# EAGLE schematic MicroMod_MAX78000_V1.0 (EAGLE 9.6.2)
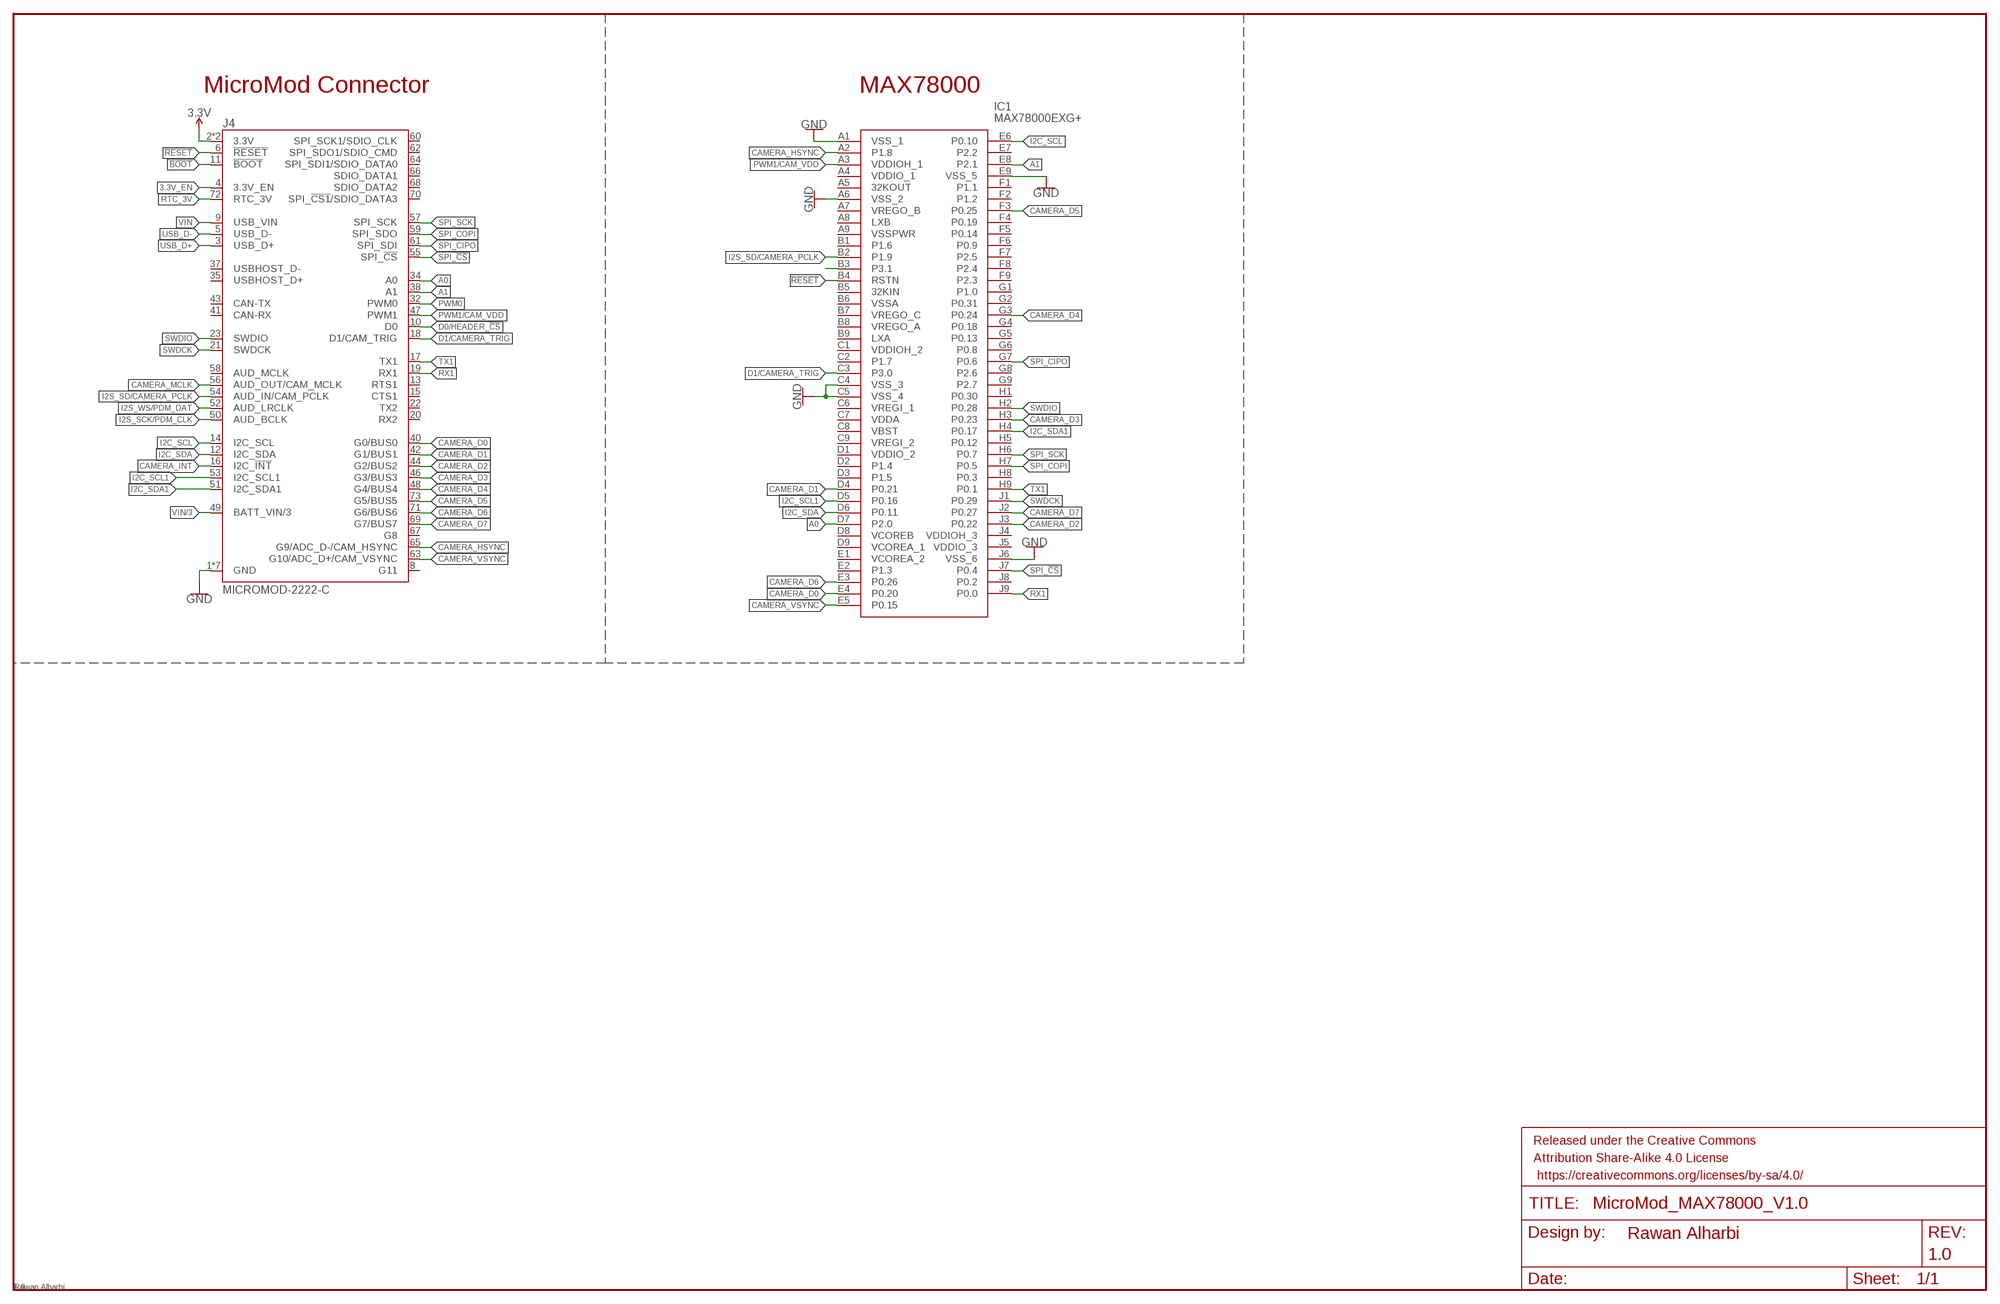
[diagram p0: schematic, sheet 1]

## Parts
FRAME1  FRAME-LEDGER  [CREATIVE_COMMONS]
IC1  MAX78000EXG+  [BGA81C80P9X9_800X800X130]
J4  MICROMOD-2222-C  [M.2-CONNECTOR-E]

## Nets
3.3V: J4.2(3.3V) J4.74(3.3V)
3.3V_EN: J4.4(3.3V_EN)
!BOOT!: J4.11(!BOOT!)
!RESET!: IC1.B4(RSTN) J4.6(!RESET!)
A0: IC1.D7(P2.0) J4.34(A0)
A1: IC1.E8(P2.1) J4.38(A1)
CAMERA_D0: IC1.E4(P0.20) J4.40(G0/BUS0)
CAMERA_D1: IC1.D4(P0.21) J4.42(G1/BUS1)
CAMERA_D2: IC1.J3(P0.22) J4.44(G2/BUS2)
CAMERA_D3: IC1.H3(P0.23) J4.46(G3/BUS3)
CAMERA_D4: IC1.G3(P0.24) J4.48(G4/BUS4)
CAMERA_D5: IC1.F3(P0.25) J4.73(G5/BUS5)
CAMERA_D6: IC1.E3(P0.26) J4.71(G6/BUS6)
CAMERA_D7: IC1.J2(P0.27) J4.69(G7/BUS7)
CAMERA_HSYNC: IC1.A2(P1.8) J4.65(G9/ADC_D-/CAM_HSYNC)
CAMERA_INT: J4.16(I2C_!INT!)
CAMERA_MCLK: J4.56(AUD_OUT/CAM_MCLK)
CAMERA_VSYNC: IC1.E5(P0.15) J4.63(G10/ADC_D+/CAM_VSYNC)
D0/HEADER_!CS!: J4.10(D0)
D1/CAMERA_TRIG: IC1.C3(P3.0) J4.18(D1/CAM_TRIG)
GND: IC1.A1(VSS_1) IC1.A6(VSS_2) IC1.C4(VSS_3) IC1.C5(VSS_4) IC1.E9(VSS_5) IC1.J6(VSS_6) J4.1(GND) J4.7(GND) J4.33(GND) J4.36(GND) J4.39(GND) J4.45(GND) J4.75(GND)
I2C_SCL: IC1.E6(P0.10) J4.14(I2C_SCL)
I2C_SCL1: IC1.D5(P0.16) J4.53(I2C_SCL1)
I2C_SDA: IC1.D6(P0.11) J4.12(I2C_SDA)
I2C_SDA1: IC1.H4(P0.17) J4.51(I2C_SDA1)
I2S_SCK/PDM_CLK: J4.50(AUD_BCLK)
I2S_SD/CAMERA_PCLK: IC1.B2(P1.9) J4.54(AUD_IN/CAM_PCLK)
I2S_WS/PDM_DAT: J4.52(AUD_LRCLK)
N$1: IC1.B3(P3.1)
PWM0: J4.32(PWM0)
PWM1/CAM_VDD: IC1.A3(VDDIOH_1) J4.47(PWM1)
RTC_3V: J4.72(RTC_3V)
RX1: IC1.J9(P0.0) J4.19(RX1)
SPI_!CS!: IC1.J7(P0.4) J4.55(SPI_!CS!)
SPI_CIPO: IC1.G7(P0.6) J4.61(SPI_SDI)
SPI_COPI: IC1.H7(P0.5) J4.59(SPI_SDO)
SPI_SCK: IC1.H6(P0.7) J4.57(SPI_SCK)
SWDCK: IC1.J1(P0.29) J4.21(SWDCK)
SWDIO: IC1.H2(P0.28) J4.23(SWDIO)
TX1: IC1.H9(P0.1) J4.17(TX1)
USB_D+: J4.3(USB_D+)
USB_D-: J4.5(USB_D-)
VIN: J4.9(USB_VIN)
VIN/3: J4.49(BATT_VIN/3)
Unconnected: IC1.A4(VDDIO_1) IC1.A5(32KOUT) IC1.A7(VREGO_B) IC1.A8(LXB) IC1.A9(VSSPWR) IC1.B1(P1.6) IC1.B5(32KIN) IC1.B6(VSSA) IC1.B7(VREGO_C) IC1.B8(VREGO_A) IC1.B9(LXA) IC1.C1(VDDIOH_2) IC1.C2(P1.7) IC1.C6(VREGI_1) IC1.C7(VDDA) IC1.C8(VBST) IC1.C9(VREGI_2) IC1.D1(VDDIO_2) IC1.D2(P1.4) IC1.D3(P1.5) IC1.D8(VCOREB) IC1.D9(VCOREA_1) IC1.E1(VCOREA_2) IC1.E2(P1.3) IC1.E7(P2.2) IC1.F1(P1.1) IC1.F2(P1.2) IC1.F4(P0.19) IC1.F5(P0.14) IC1.F6(P0.9) IC1.F7(P2.5) IC1.F8(P2.4) IC1.F9(P2.3) IC1.G1(P1.0) IC1.G2(P0.31) IC1.G4(P0.18) IC1.G5(P0.13) IC1.G6(P0.8) IC1.G8(P2.6) IC1.G9(P2.7) IC1.H1(P0.30) IC1.H5(P0.12) IC1.H8(P0.3) IC1.J4(VDDIOH_3) IC1.J5(VDDIO_3) IC1.J8(P0.2) J4.8(G11) J4.13(RTS1) J4.15(CTS1) J4.20(RX2) J4.22(TX2) J4.35(USBHOST_D+) J4.37(USBHOST_D-) J4.41(CAN-RX) J4.43(CAN-TX) J4.58(AUD_MCLK) J4.60(SPI_SCK1/SDIO_CLK) J4.62(SPI_SDO1/SDIO_CMD) J4.64(SPI_SDI1/SDIO_DATA0) J4.66(SDIO_DATA1) J4.67(G8) J4.68(SDIO_DATA2) J4.70(SPI_!CS1!/SDIO_DATA3)

## Notes on the sheet
- MicroMod Connector | MAX78000

## Library data of the parts
FRAME1 = SparkFun-Aesthetics:FRAME-LEDGER: Schematic Frame - Ledger Standard 11x14 US Ledger frame; DESIGNER: Rawan Alharbi; REV: 1.0
IC1 = MAX78000EXG+:MAX78000EXG+: ARM Microcontrollers - MCU ARM M4F w/ 432KB Weight CNN Accelerator, CTBGA Source: Datasheet <https://pdfserv.maximintegrated.com/en/ds/MAX78000.pdf>; DESCRIPTION: ARM Microcontrollers - MCU ARM M4F w/ 432KB Weight CNN Accelerator, CTBGA; HEIGHT: 1.3mm; MANUFACTURER_NAME: Maxim Integrated; MANUFACTURER_PART_NUMBER: MAX78000EXG+
J4 = SparkFun-MicroMod:MICROMOD: MicroMod Connector Description: A card edge connector and mating PCB connector to allow various MicroMod Processor Boards to be coupled with various carrier boards of different capabilities. Based on the M.2 standard.; PROD_ID: CONN-14877

## Net classes
0 default: width 0 mm, drill 0 mm